# EAGLE design GBA Wireless Gamepad (EAGLE 6.2)
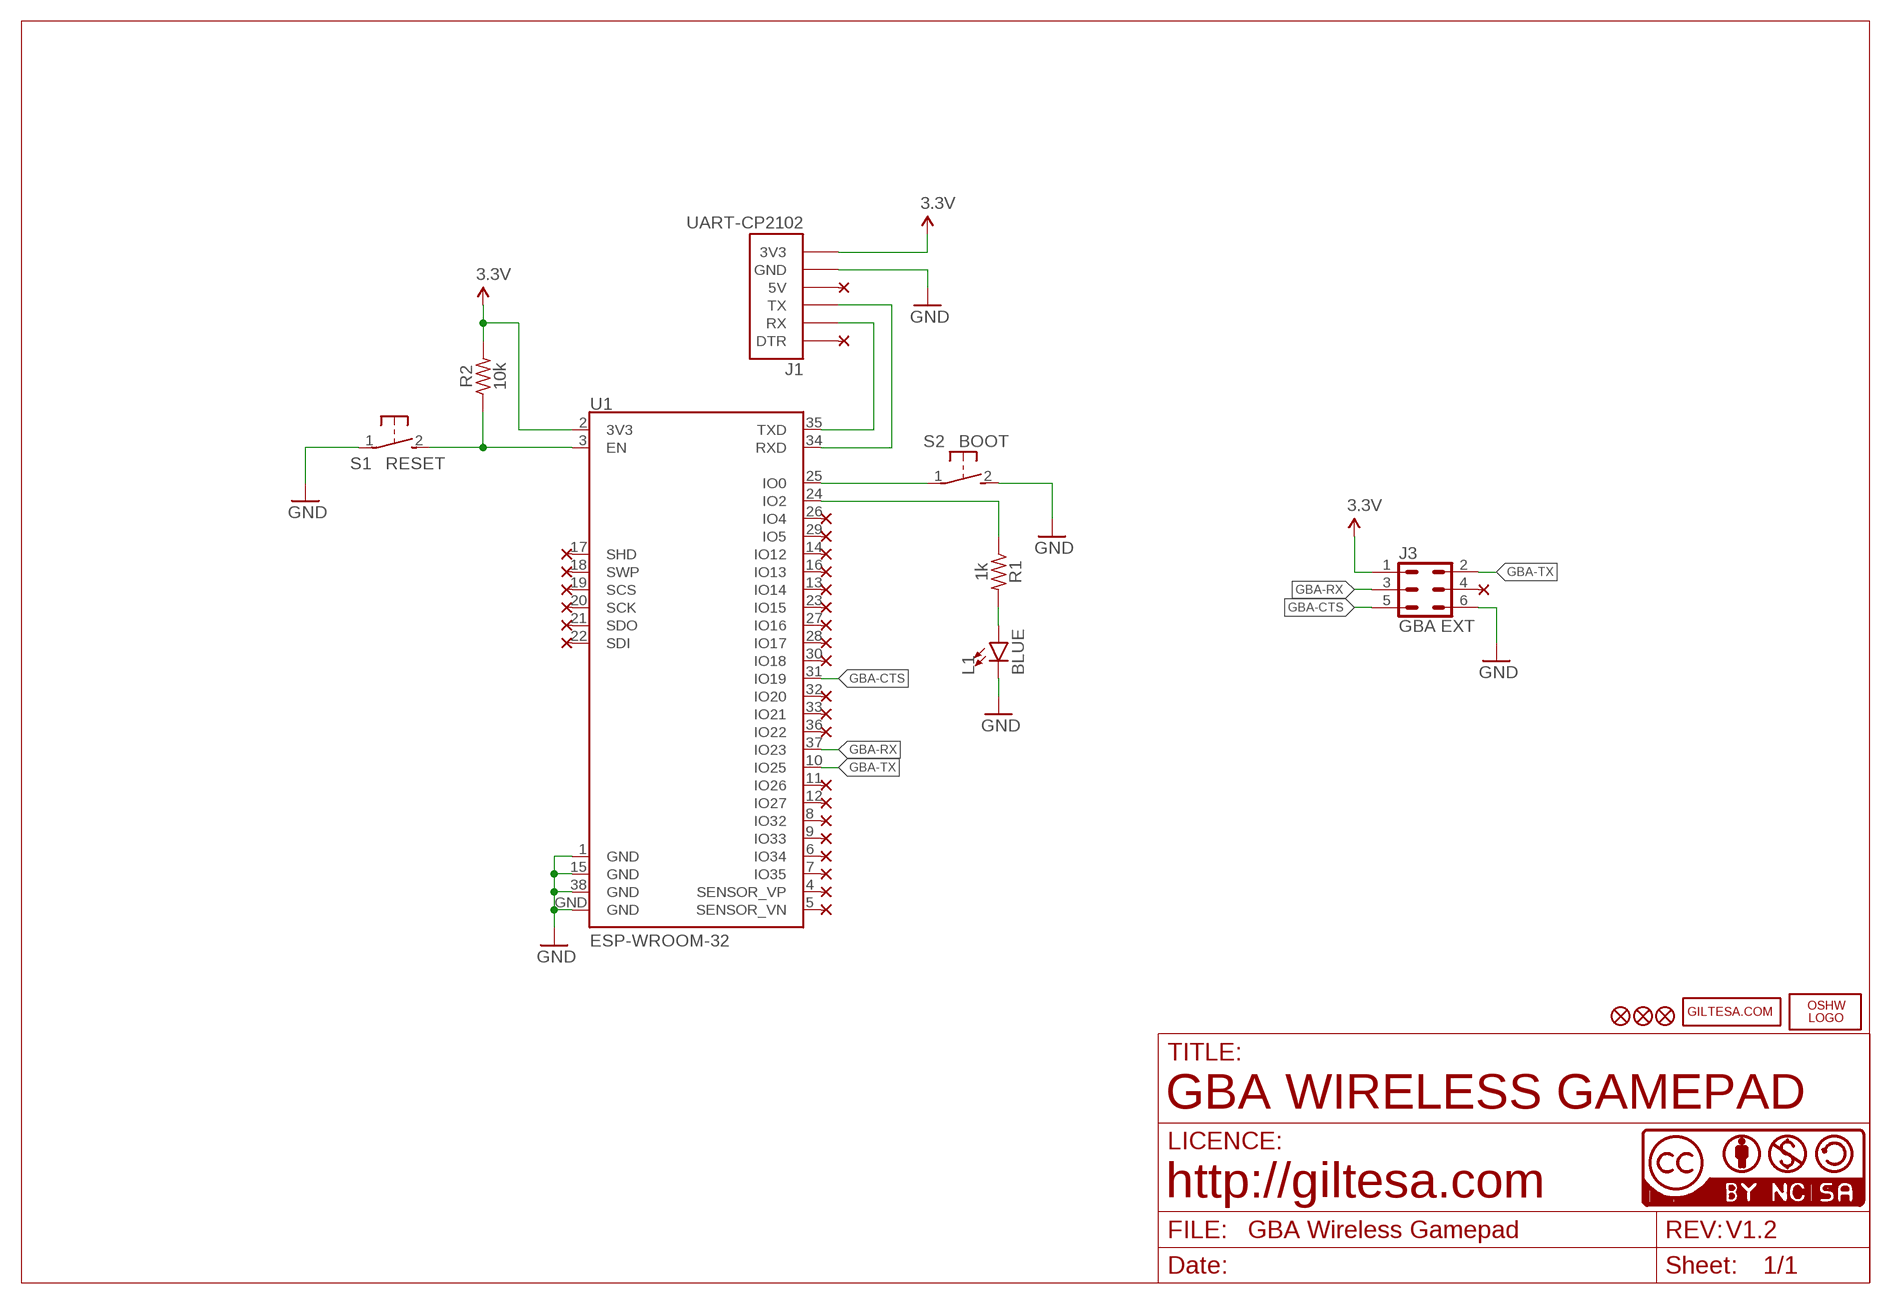
[diagram p0: schematic, sheet 1]

## Parts
J1  UART-CP2102  [UART-CP2102]
J3  GBA EXT  GBA_EXT  [GBA_EXT]
L1  BLUE  LED-BLUE0603  [LED-0603]
LOGO1  OSHW_LOGO_FILLX0150-NT  [OSHW_FILLX150_NOTEXT]
R1  1k  R0603  [R0603]
R2  10k  R0603  [R0603]
S1  RESET  SWITCH_2P4.6X2.8MM  [SWITCH_SMD_4.6X2.8MM]
S2  BOOT  SWITCH_2P4.6X2.8MM  [SWITCH_SMD_4.6X2.8MM]
U1  ESP-WROOM-32  ESP32-WROOMNARROW  [ESP32-WROOM-NARROW]
U$6  FIDUCIAL1X2  [FIDUCIAL-1X2]
U$7  FIDUCIAL1X2  [FIDUCIAL-1X2]
U$10  GILTESA.COM_MASK  [GILTESA.COM_MASK_15MM]
U$14  FIDUCIAL1X2  [FIDUCIAL-1X2]
U$17  CC-NC-BCNIX  [CC-NC-B_NIX]

## Nets
3.3V: J1.3V3 J3.1 R2.2 U1.2(3V3)
CHIP_PU: R2.1 S1.2(B) U1.3(EN)
GBA-CTS: J3.5 U1.31(IO19)
GBA-RX: J3.3 U1.37(IO23)
GBA-TX: J3.2 U1.10(IO25)
GND: J1.GND J3.6 L1.C S1.1(A) S2.2(B) U1.1(GND) U1.15(GND) U1.38(GND) U1.GND
N$1: S2.1(A) U1.25(IO0)
N$2: L1.A R1.2
N$3: R1.1 U1.24(IO2)
RX: J1.TX U1.34(RXD)
TX: J1.RX U1.35(TXD)
Unconnected: J1.5V J1.DTR J3.4 U1.4(SENSOR_VP) U1.5(SENSOR_VN) U1.6(IO34) U1.7(IO35) U1.8(IO32) U1.9(IO33) U1.11(IO26) U1.12(IO27) U1.13(IO14) U1.14(IO12) U1.16(IO13) U1.17(SHD) U1.18(SWP) U1.19(SCS) U1.20(SCK) U1.21(SDO) U1.22(SDI) U1.23(IO15) U1.26(IO4) U1.27(IO16) U1.28(IO17) U1.29(IO5) U1.30(IO18) U1.32(IO20) U1.33(IO21) U1.36(IO22)

## Notes on the sheet
- GBA WIRELESS GAMEPAD
- http://giltesa.com
- V1.2

## Library data of the parts
J1 = ,giltesa:UART-CP2102
J3 = ,giltesa:GBA_EXT
L1 = SparkFun-LED:LED-BLUE: Blue SMD LED Used in manufacturing of various products at SparkFun Packages: 0603 - SMD 0603 package [Product Link] <http://www.digikey.com/product-detail/en/SMLE12BC7TT86/511-1589-2-ND/1641808> 1206 - SMD1206 package [Product Link] <http://www.digikey.com/product-detail/en/lite-on-inc/LTST-C150TBKT/160-1643-1-ND/573584> SparkFun Products: ESP8266 Thing-Dev Board <https://www.sparkfun.com/products/13711> RedBoard <https://www.sparkfun.com/products/12757>; PROD_ID: DIO-08575
LOGO1 = ohw-logo:OSHW_LOGO_FILL
R1 R2 = ,giltesa:R0603
S1 S2 = ,giltesa:SWITCH_2P
U1 = ,giltesa:ESP32-WROOM; PROD_ID: IC-13849
U$6 U$7 U$14 = SparkFun:FIDUCIAL: Fiducial Alignment Points Various fiducial points for machine vision alignment.
U$10 = ,giltesa_logos:GILTESA.COM
U$17 = cc-by-nc-sa:CC-NC-BC: All hardware is licensed under the Creative Commons Attribution-Noncommercial-Share Alike 2.5 Switzerland License. To view a copy of this license, visit http://creativecommons.org/licenses/by-nc-sa/2.5/ch/ or send a letter to Creative Commons, 171 Second Street, Suite 300, San Francisco, California, 94105, USA.

## Board
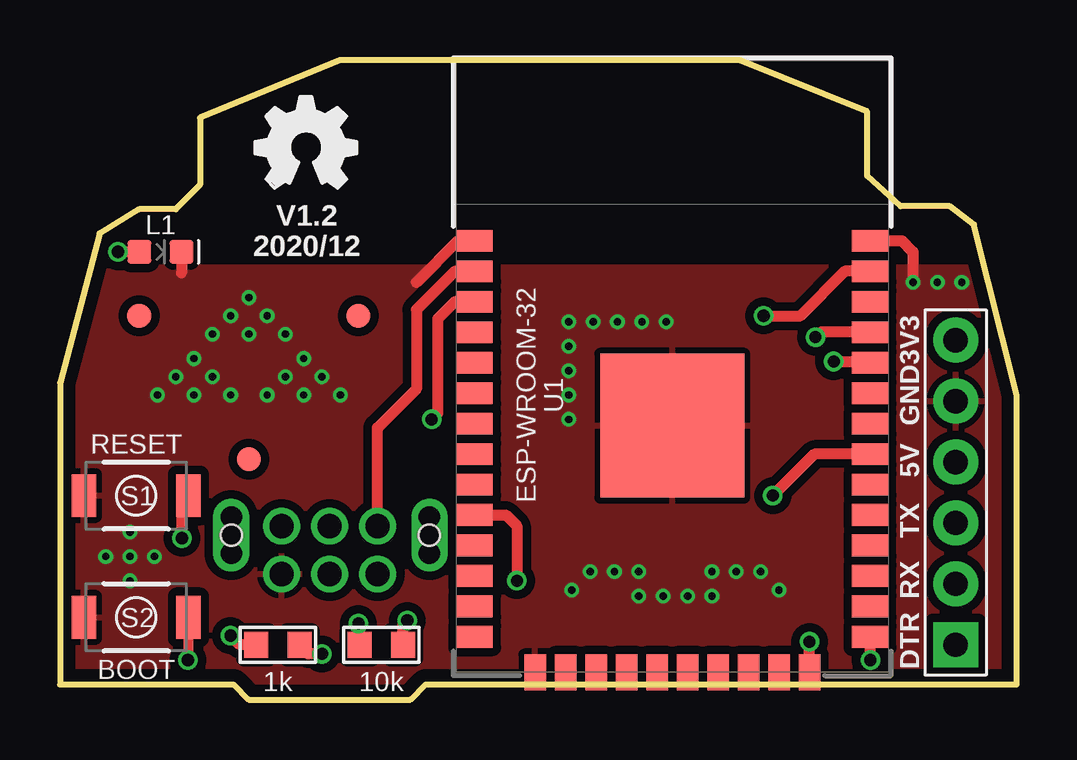
[diagram p1: board, top side]
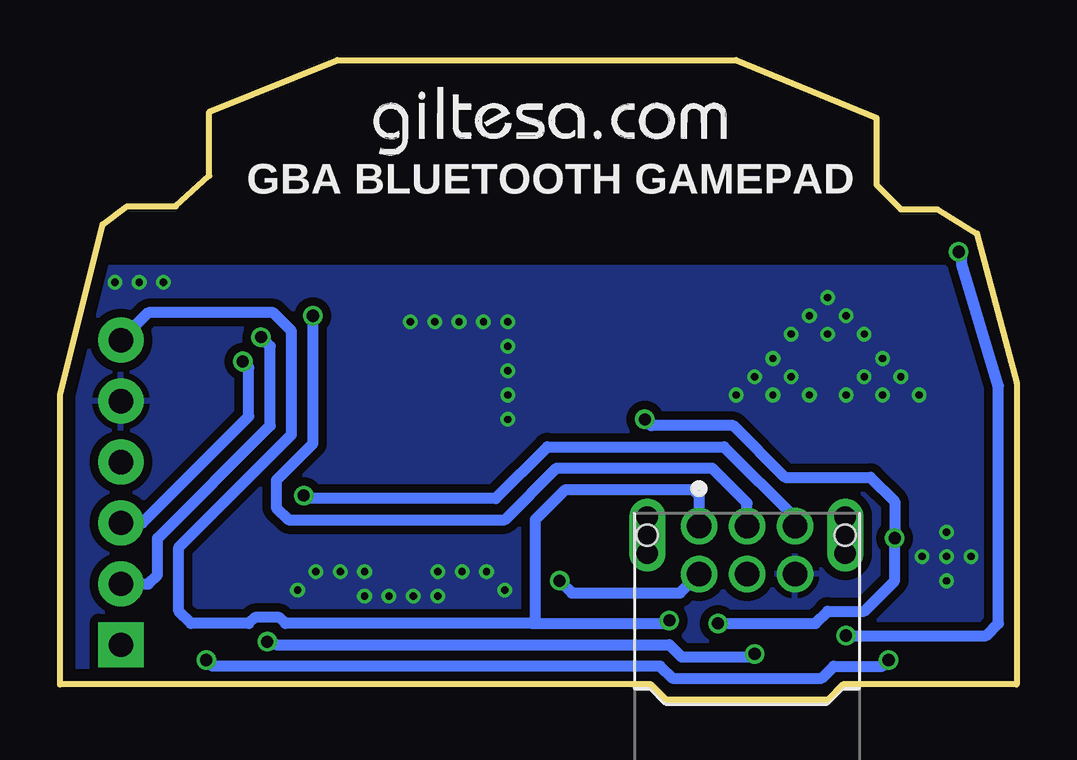
[diagram p2: board, bottom side, seen from below]

Size 39.88 x 26.67 mm. Coordinates in mm from the lower left corner, seen from the top.
Outline: 0,0.64 7.24,0.64 7.87,0 14.61,0 15.24,0.64 39.88,0.64 39.88,12.7 38.1,19.81 37.08,20.57 35.05,20.57 33.66,21.84 33.66,24.51 28.32,26.67 11.68,26.67 5.84,24.26 5.84,21.46 4.83,20.45 3.3,20.45 1.65,19.43 0,13.21 0,0.64
Copper layers (1*16): Top 0.035mm / dielectric 1.6mm / Bottom 0.035mm
Design rules: minimum track width 6mil, minimum drill 12mil, track to track 6mil, track to pad 6mil, pad to pad 6mil, via to via 8mil, smd to smd 0mil, copper to edge 20mil, drill to drill 10mil, minimum pad ring 6mil, minimum via ring 6mil, stop-mask expansion 0mil, vias tented up to drill 100mil, thermal gap 10mil

### Footprints (pad centres in the part's own frame; a part is rotated, then mirrored left to right if it is on the bottom)
UART-CP2102 = drill 1.016 pad 1.88: 3V3 6.35,0; 5V 1.27,0; GND 3.81,0; RX -3.81,0; TX -1.27,0 | drill 1.016 pad 1.88 square: DTR -6.35,0
GBA_EXT = drill 1.016: 1 2,-7.366; 2 2,-5.366; 3 0,-7.366; 4 0,-5.366; 5 -2,-7.366; 6 -2,-5.366 | drill 0.889 pad 1.524 offset: NC1 4.159,-6.223; NC2 4.159,-7.747; NC3 -4.096,-6.223; NC4 -4.096,-7.747 | hole 0.889: 4.159,-6.985; -4.096,-6.985
LED-0603 = smd 1 x 1: A -0.877,0; C 0.877,0
R0603 = smd 1 x 1.1: 1 -0.901,0; 2 0.901,0
SWITCH_SMD_4.6X2.8MM = smd 1.016 x 1.778: 1 -2.177,0; 2 2.177,0
ESP32-WROOM-NARROW = smd 1.5 x 0.9: 1 -8.238,6.43; 2 -8.238,5.16; 3 -8.238,3.89; 4 -8.238,2.62; 5 -8.238,1.35; 6 -8.238,0.08; 7 -8.238,-1.19; 8 -8.238,-2.46; 9 -8.238,-3.73; 10 -8.238,-5; 11 -8.238,-6.27; 12 -8.238,-7.54; 13 -8.238,-8.81; 14 -8.238,-10.08; 25 8.238,-10.08; 26 8.238,-8.81; 27 8.238,-7.54; 28 8.238,-6.27; 29 8.238,-5; 30 8.238,-3.73; 31 8.238,-2.46; 32 8.238,-1.19; 33 8.238,0.08; 34 8.238,1.35; 35 8.238,2.62; 36 8.238,3.89; 37 8.238,5.16; 38 8.238,6.43 | smd 0.9 x 1.5: 15 -5.715,-11.57; 16 -4.445,-11.57; 17 -3.175,-11.57; 18 -1.905,-11.57; 19 -0.635,-11.57; 20 0.635,-11.57; 21 1.905,-11.57; 22 3.175,-11.57; 23 4.445,-11.57; 24 5.715,-11.57 | smd 6 x 6: GND 0,-1.27
FIDUCIAL-1X2 = smd 1 x 1: 1 0,0

### Placement (x,y rotation side)
J1  37.34,8.64 90 top
J3  11.24,-0.13 180 bottom
L1  4.19,18.67 0 top
LOGO1  8.13,21.34 0 top
R1  9.08,2.29 180 top
R2  13.4,2.29 0 top
S1  3.17,8.51 0 top
S2  3.17,3.43 180 top
U1  25.53,12.7 0 top
U$6  3.3,16 0 top
U$7  12.45,16 0 top
U$10  26.92,22.61 0 bottom
U$14  7.87,10.03 0 top
U$17  -0.13,0.64 0 top

### Tracks (layer width: path | path; a pad name or v marks a point on that pad's centre or on a via)
3.3V  (via drill 0.51)
  Top 0.457: v14.48,3.3 14.3,3.12 R2.2 | U1.2 16.46,17.86 14.86,16.26 14.86,12.95 13.24,11.33 J3.1
  Bottom 0.457: J3.1 13.24,8.51 13.49,8.76 18.8,8.76 20.07,7.49 20.07,3.3 20.19,3.17 | 20.19,3.17 30.48,3.17 30.73,3.43 31.75,3.43 32,3.17 34.42,3.17 34.92,3.68 34.92,6.35 30.23,11.05 30.23,15.37 30.99,16.13 36.2,16.13 J1.3V3 | v14.48,3.3 14.61,3.17 20.19,3.17
CHIP_PU  (via drill 0.51)
  Top 0.406: v5.08,6.73 5.08,8.24 S1.2
  Top 0.457: v12.45,3.17 12.5,3.12 R2.1 | U1.3 16.46,16.59 15.75,15.88 15.75,11.94 v15.49,11.68
  Bottom 0.457: v15.49,11.68 15.24,11.43 11.81,11.43 9.65,9.27 6.1,9.27 5.08,8.26 v5.08,6.73 5.08,4.95 6.35,3.68 7.87,3.68 8.38,3.17 v12.45,3.17
GBA-CTS  (via drill 0.51)
  Top 0.457: U1.31 31.45,10.24 v29.72,8.51
  Bottom 0.457: J3.5 9.24,7.59 12.19,10.54 19.56,10.54 21.72,8.38 29.59,8.38 v29.72,8.51
GBA-RX  (via drill 0.51)
  Top 0.457: U1.37 32.72,17.86 30.86,16 v29.34,16
  Bottom 0.457: v29.34,16 29.34,10.67 30.86,9.14 30.86,8 30.35,7.49 21.34,7.49 19.18,9.65 12.7,9.65 11.24,8.19 J3.3
GBA-TX  (via drill 0.51)
  Top 0.457: U1.10 18.59,7.7 19.05,7.24 v19.05,4.95
  Bottom 0.457: v19.05,4.95 18.54,4.45 14.03,4.45 J3.2
GND  (via drill 0.3)
  Top 0.457: U1.38 35.1,19.13 35.56,18.67 v35.56,17.4 | U1.1 16.59,19.13 14.86,17.4 | L1.C 5.07,17.79
  other vias: 36.58,17.4 37.59,17.4 1.91,5.97 2.92,5.97 3.94,5.97 7.87,16.76 24.26,15.75 23.24,15.75 25.27,15.75 22.23,15.75 21.21,15.75 21.21,13.72 21.21,12.7 21.21,11.68 21.21,14.73 25.15,4.32 26.16,4.32 24.13,4.32 27.18,4.32 27.18,5.33 28.19,5.33 29.21,5.33 24.13,5.33 23.11,5.33 22.1,5.33 21.34,4.57 29.97,4.57 7.11,16 8.64,16 6.35,15.24 7.87,15.24 9.4,15.24 5.59,14.22 4.83,13.46 6.35,13.46 4.06,12.7 5.59,12.7 7.11,12.7 10.16,14.22 9.4,13.46 10.92,13.46 8.64,12.7 10.16,12.7 11.68,12.7 2.92,6.98 2.92,4.95
  pour Top (isolate 0.356): -1.27,-0.76 41.27,-0.76 41.27,18.03 -1.27,18.03
  pour Bottom (isolate 0.356): -1.27,-0.76 41.27,-0.76 41.27,18.03 -1.27,18.03
N$1  (via drill 0.51)
  Top 0.406: S2.1 5.35,1.67 v5.33,1.65
  Top 0.457: 5.22,1.76 v5.33,1.65 | U1.25 33.77,1.67 v33.78,1.65
  Bottom 0.457: v33.78,1.65 33.53,1.4 14.86,1.4 14.35,0.89 8.13,0.89 7.62,1.4 5.59,1.4 v5.33,1.65
N$2  (via drill 0.51)
  Top 0.457: R1.2 7.49,2.29 v7.11,2.67 | L1.A v2.41,18.67
  Bottom 0.457: v7.11,2.67 1.27,2.67 0.76,3.17 0.76,13.08 2.29,18.16 2.29,18.54 v2.41,18.67
N$3  (via drill 0.51)
  Top 0.457: U1.24 v31.24,2.41 | v10.92,1.91 10.36,1.91 R1.1
  Bottom 0.457: v31.24,2.41 30.86,2.29 14.48,2.29 13.97,1.78 11.05,1.78 v10.92,1.91
RX  (via drill 0.51)
  Top 0.457: v32.26,14.1 33.72,14.1 U1.34
  Bottom 0.457: J1.TX 36.45,7.37 32,11.81 32,13.84 v32.26,14.1
TX  (via drill 0.51)
  Top 0.457: U1.35 31.7,15.32 v31.5,15.11
  Bottom 0.457: J1.RX 36.2,4.83 35.81,5.21 35.81,6.73 31.11,11.43 31.11,14.73 v31.5,15.11

### Text on the board
tPlace: V1.2 | 2020/12
bPlace: GBA BLUETOOTH GAMEPAD